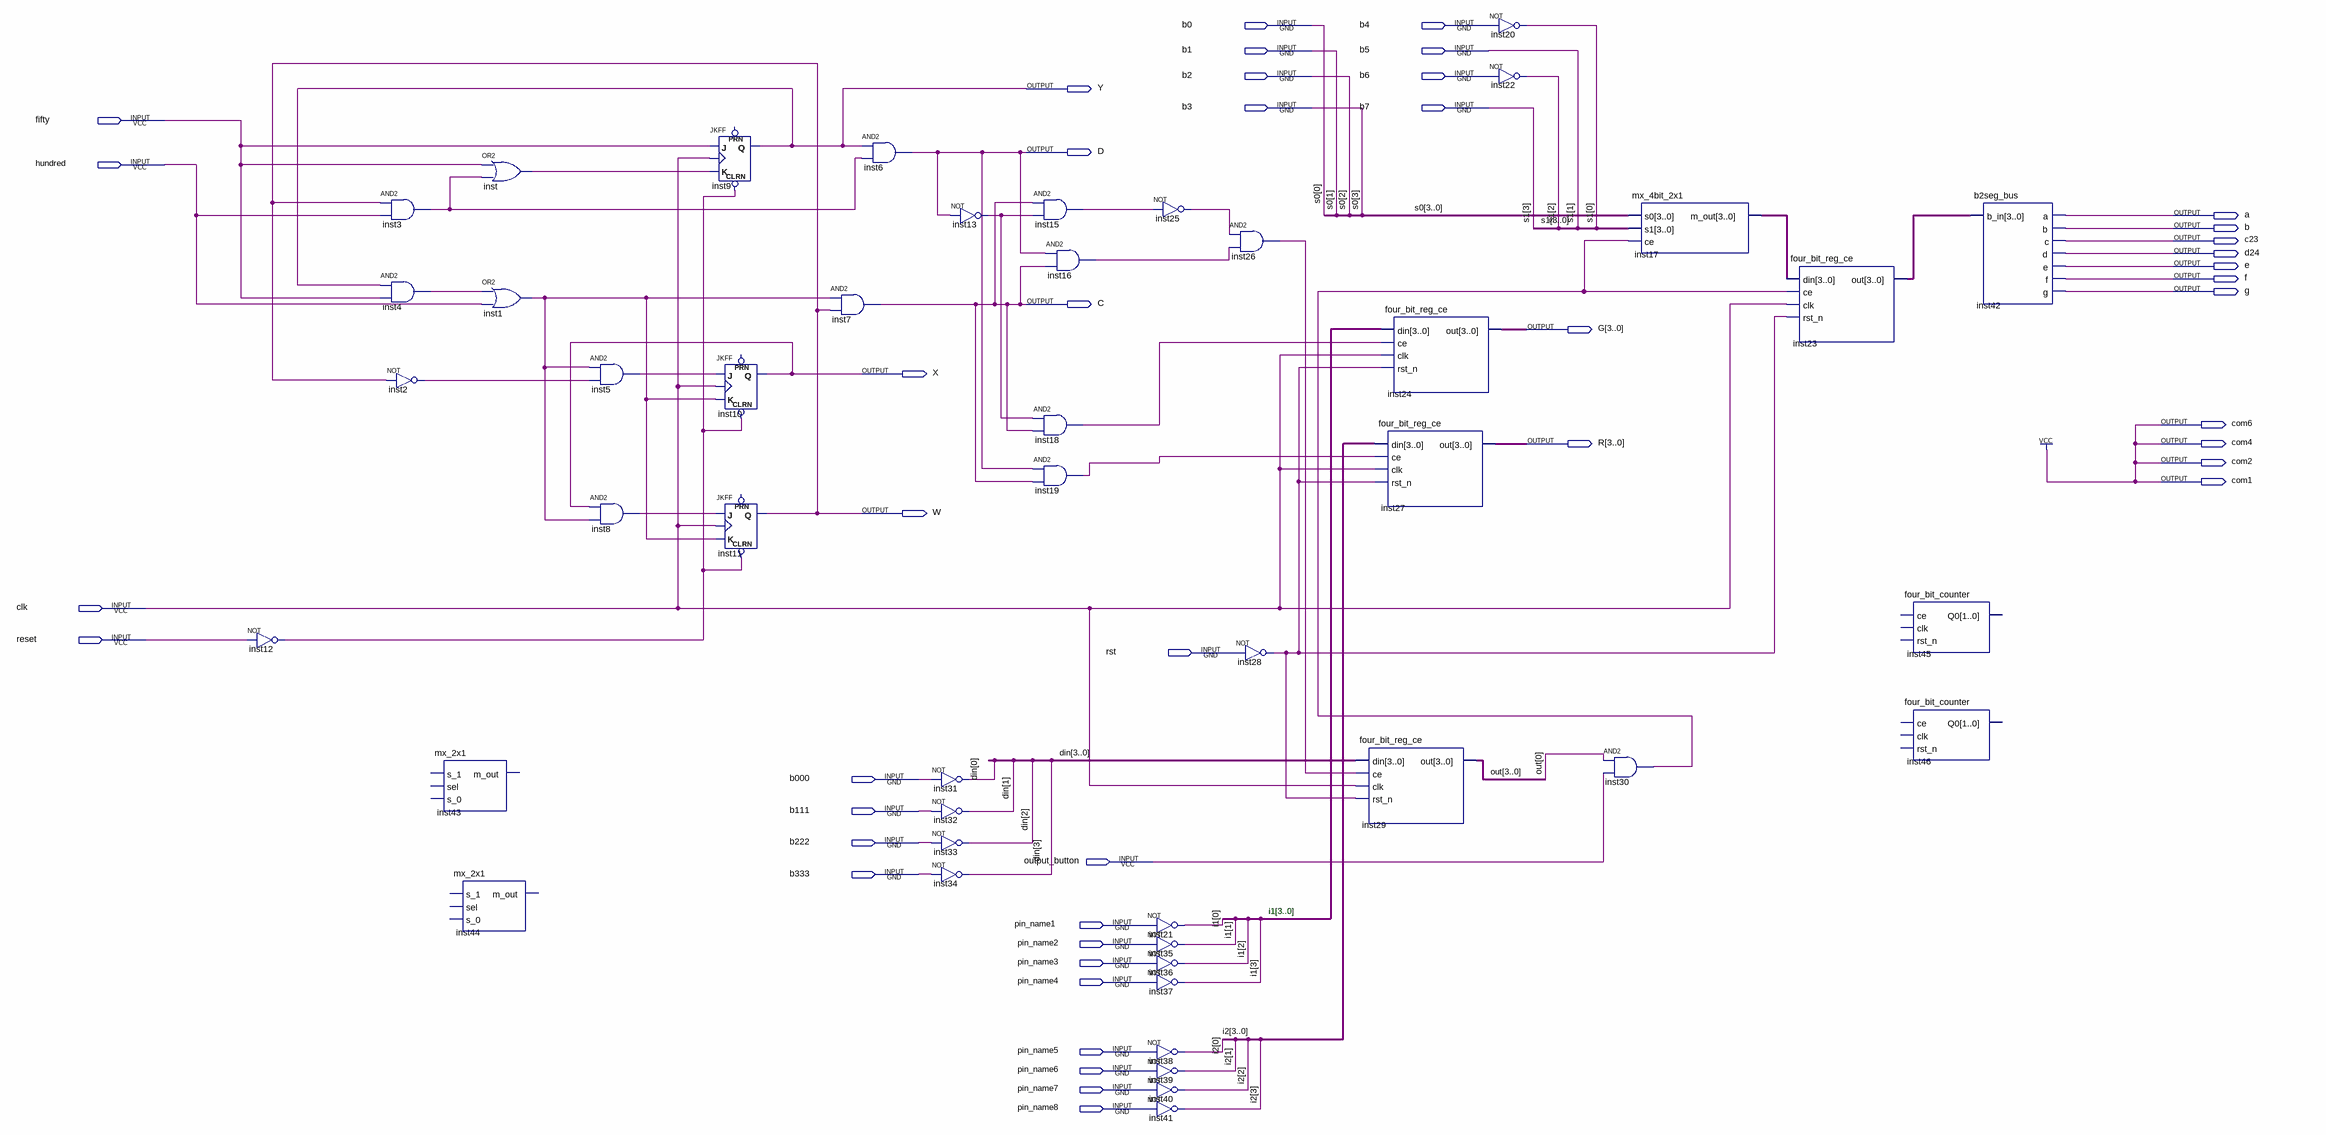
[diagram p0: schematic sheet]
// Quartus schematic calculator.bdf as structural Verilog: 46 symbols, 44 pins
module calculator (
  input  b0,
  input  b4,
  input  b1,
  input  b5,
  input  b2,
  input  b6,
  input  b3,
  input  b7,
  input  fifty,
  input  hundred,
  input  clk,
  input  reset,
  input  rst,
  input  b000,
  input  b111,
  input  b222,
  input  output_button,
  input  b333,
  input  pin_name1,
  input  pin_name2,
  input  pin_name3,
  input  pin_name4,
  input  pin_name5,
  input  pin_name6,
  input  pin_name7,
  input  pin_name8,
  output Y,
  output D,
  output a,
  output b,
  output c23,
  output d24,
  output e,
  output f,
  output g_1bit,
  output C,
  output [3:0] g,
  output X,
  output com6,
  output [3:0] R,
  output com4,
  output com2,
  output com1,
  output W
);

  wire inst1_out, inst2_out, inst3_out, inst4_out, inst5_out, inst8_out, inst12_out, inst13_out, inst15_out,
       inst16_out, inst18_out, inst19_out, inst25_out, inst26_out, inst28_out, inst30_out, inst_out;
  wire [2:0] s1;
  wire [3:0] din, i1, i2, inst17_m_out, inst23_out, out;

  not inst12 (inst12_out, reset);
  and inst3 (inst3_out, W, hundred);
  and inst4 (inst4_out, Y, fifty);
  not inst2 (inst2_out, W);
  mx_2x1 inst43 ();  // open: s_1, sel, s_0, m_out
  mx_2x1 inst44 ();  // open: s_1, sel, s_0, m_out
  or inst (inst_out, fifty, inst3_out);
  or inst1 (inst1_out, inst4_out, hundred);
  and inst5 (inst5_out, inst1_out, inst2_out);
  and inst8 (inst8_out, X, inst1_out);
  JKFF inst9 (.CLRN(inst12_out), .K(inst_out), .J(fifty), .CLK(clk), .Q(Y));  // open: PRN
  JKFF inst10 (.CLRN(inst12_out), .K(inst1_out), .J(inst5_out), .CLK(clk), .Q(X));  // open: PRN
  JKFF inst11 (.CLRN(inst12_out), .K(inst1_out), .J(inst8_out), .CLK(clk), .Q(W));  // open: PRN
  and inst6 (D, Y, inst3_out);
  and inst7 (C, inst1_out, W);
  not inst13 (inst13_out, D);
  not inst31 (din[0], b000);
  not inst32 (din[1], b111);
  not inst33 (din[2], b222);
  not inst34 (din[3], b333);
  and inst15 (inst15_out, C, inst13_out);
  and inst16 (inst16_out, D, C);
  and inst18 (inst18_out, inst13_out, C);
  and inst19 (inst19_out, D, C);
  not inst25 (inst25_out, inst15_out);
  not inst21 (i1[0], pin_name1);
  not inst35 (i1[1], pin_name2);
  not inst36 (i1[2], pin_name3);
  not inst37 (i1[3], pin_name4);
  not inst38 (i2[0], pin_name5);
  not inst39 (i2[1], pin_name6);
  not inst40 (i2[2], pin_name7);
  not inst41 (i2[3], pin_name8);
  and inst26 (inst26_out, inst25_out, inst16_out);
  not inst28 (inst28_out, rst);
  four_bit_reg_ce inst27 (.din(i2), .ce(inst19_out), .clk(clk), .rst_n(inst28_out), .out(R));
  four_bit_reg_ce inst29 (.din(din), .ce(inst26_out), .clk(clk), .rst_n(inst28_out), .out(out));
  four_bit_reg_ce inst24 (.din(i1), .ce(inst18_out), .clk(clk), .rst_n(inst28_out), .out(g));
  not inst20 (s1[0], b4);
  not inst22 (s1[2], b6);
  mx_4bit_2x1 inst17 (.s0({b3, b2, b1, b0}), .s1({b7, s1[2], b5, s1[0]}), .ce(inst30_out), .m_out(inst17_m_out));
  and inst30 (inst30_out, out[0], output_button);
  four_bit_reg_ce inst23 (.din(inst17_m_out), .ce(inst30_out), .clk(clk), .rst_n(inst28_out), .out(inst23_out));
  four_bit_counter inst45 ();  // open: ce, clk, rst_n, Q0
  four_bit_counter inst46 ();  // open: ce, clk, rst_n, Q0
  b2seg_bus inst42 (.b_in(inst23_out), .a(a), .b(b), .c(c23), .d(d24), .e(e), .f(f), .g(g_1bit));

  assign com1 = 1'b1;
  assign com2 = 1'b1;
  assign com4 = 1'b1;
  assign com6 = 1'b1;

  // Other names for the same wires on the sheet: s0[3:0] = {b3, b2, b1, b0}; s1 (some bits) = {b7, b5}

  // Notes on the sheet:
  //   i1[3..0]
endmodule
